# EAGLE design M401H (EAGLE 6.6.0)
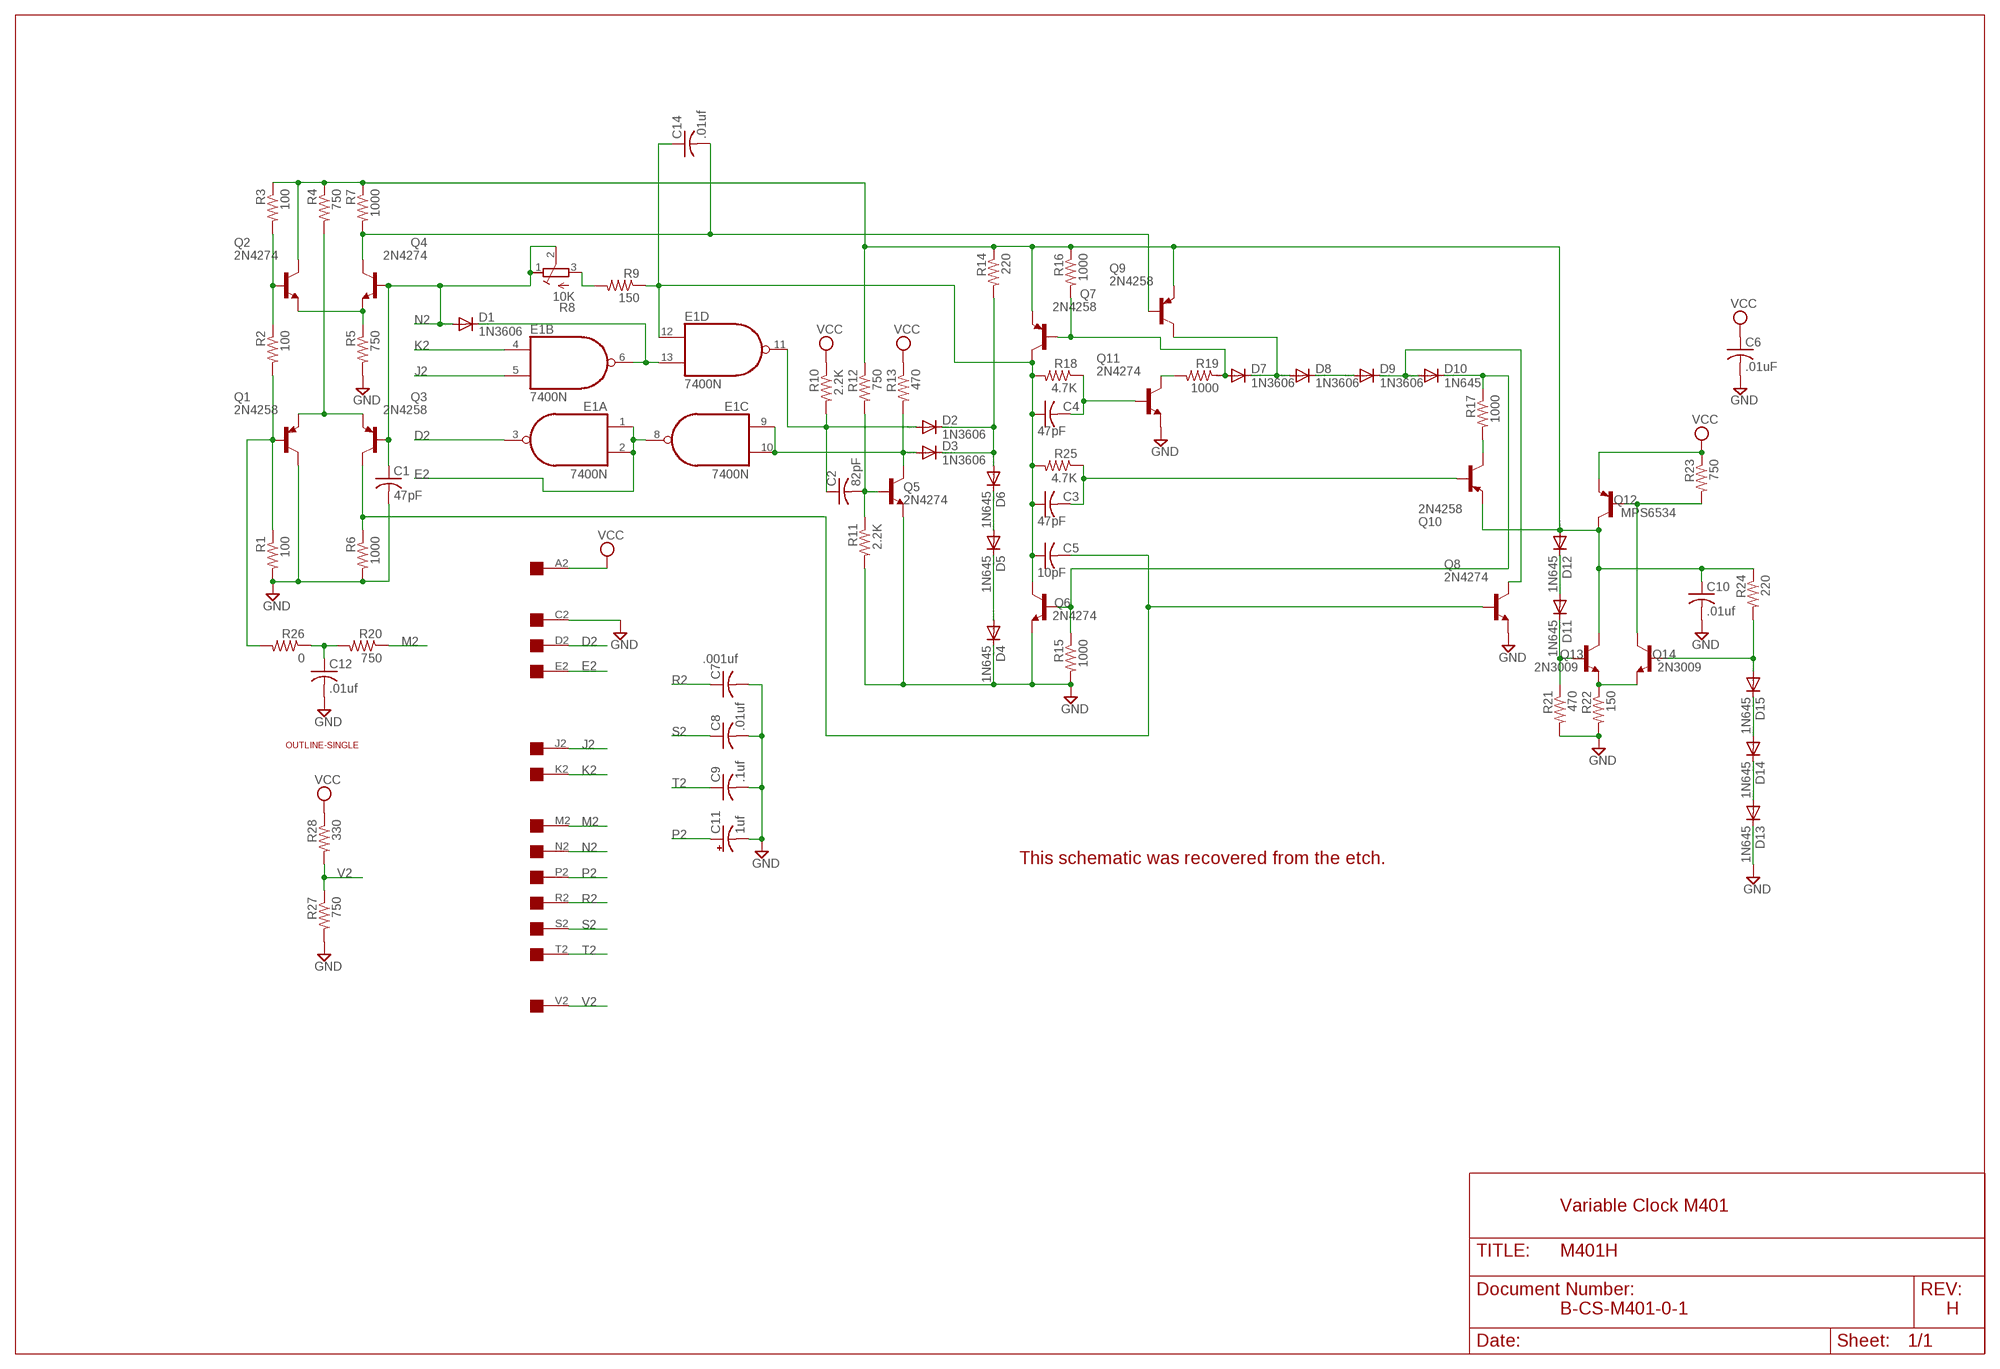
[diagram p0: schematic, sheet 1]

## Parts
C1  47pF  C-US075-032X103  [C075-032X103]
C2  82pF  C-US050-025X075  [C050-025X075]
C3  47pF  C-US050-025X075  [C050-025X075]
C4  47pF  C-US050-025X075  [C050-025X075]
C5  10pF  C-US050-025X075  [C050-025X075]
C6  .01uF  C-US102-043X133  [C102-043X133]
C7  .001uf  C-US075-032X103  [C075-032X103]
C8  .01uf  C-US225-062X268  [C225-062X268]
C9  .1uf  C-US275-093X316  [C275-093X316]
C10  .01uf  C-US050-025X075  [C050-025X075]
C11  1uf  CPOL-USE15-5AXIAL  [E15-5]
C12  .01uf  C-US050-025X075  [C050-025X075]
C14  .01uf  C-US050-025X075  [C050-025X075]
D1  1N3606  1N4148DO35-10  [DO35-10]
D2  1N3606  1N4148DO35-10  [DO35-10]
D3  1N3606  1N4148DO35-10  [DO35-10]
D4  1N645  1N4148DO35-10  [DO35-10]
D5  1N645  1N4148DO35-10  [DO35-10]
D6  1N645  1N4148DO35-10  [DO35-10]
D7  1N3606  1N4148DO35-10  [DO35-10]
D8  1N3606  1N4148DO35-10  [DO35-10]
D9  1N3606  1N4148DO35-10  [DO35-10]
D10  1N645  1N4148DO35-10  [DO35-10]
D11  1N645  1N4148DO35-10  [DO35-10]
D12  1N645  1N4148DO35-10  [DO35-10]
D13  1N645  1N4148DO35-10  [DO35-10]
D14  1N645  1N4148DO35-10  [DO35-10]
D15  1N645  1N4148DO35-10  [DO35-10]
E1  7400N  [DIL14]
Q1  2N4258  2N3637-PNP-TO39-EBC  [TO39]
Q2  2N4274  2N3019-NPN-TO39-EBC  [TO39]
Q3  2N4258  2N3637-PNP-TO39-EBC  [TO39]
Q4  2N4274  2N3019-NPN-TO39-EBC  [TO39]
Q5  2N4274  2N3019-NPN-TO39-EBC  [TO39]
Q6  2N4274  2N3019-NPN-TO39-EBC  [TO39]
Q7  2N4258  2N3637-PNP-TO39-EBC  [TO39]
Q8  2N4274  2N3019-NPN-TO39-EBC  [TO39]
Q9  2N4258  2N3637-PNP-TO39-EBC  [TO39]
Q10  2N4258  2N3637-PNP-TO39-EBC  [TO39]
Q11  2N4274  2N3019-NPN-TO39-EBC  [TO39]
Q12  MPS6534  2N3637-PNP-TO39-EBC  [TO39]
Q13  2N3009  2N3019-NPN-TO39-EBC  [TO39]
Q14  2N3009  2N3019-NPN-TO39-EBC  [TO39]
R1  100  R-US_0207/10  [0207/10]
R2  100  R-US_0207/10  [0207/10]
R3  100  R-US_0207/10  [0207/10]
R4  750  R-US_0207/10  [0207/10]
R5  750  R-US_0207/10  [0207/10]
R6  1000  R-US_0207/10  [0207/10]
R7  1000  R-US_0207/10  [0207/10]
R8  10K  275P  [3006Y]
R9  150  R-US_0207/10  [0207/10]
R10  2.2K  R-US_0207/10  [0207/10]
R11  2.2K  R-US_0207/10  [0207/10]
R12  750  R-US_0207/10  [0207/10]
R13  470  R-US_0207/10  [0207/10]
R14  220  R-US_0207/10  [0207/10]
R15  1000  R-US_0207/10  [0207/10]
R16  1000  R-US_0207/10  [0207/10]
R17  1000  R-US_0207/10  [0207/10]
R18  4.7K  R-US_0207/10  [0207/10]
R19  1000  R-US_0207/10  [0207/10]
R20  750  R-US_0207/10  [0207/10]
R21  470  R-US_0207/10  [0207/10]
R22  150  R-US_0207/10  [0207/10]
R23  750  R-US_0207/10  [0207/10]
R24  220  R-US_0207/10  [0207/10]
R25  4.7K  R-US_0207/10  [0207/10]
R26  0  R-US_0207/10  [0207/10]
R27  750  R-US_0207/10  [0207/10]
R28  330  R-US_0207/10  [0207/10]
U$1  OUTLINE-SINGLE  [SINGLE]
U$2  EDGE-1  [EDGE-CON1]

## Nets
D2: E1.3(A:O) U$2.D2
E2: E1.1(A:I0) E1.2(A:I1) E1.8(C:O) U$2.E2
GND [power]: C1.2 C6.2 C7.2 C8.2 C9.2 C10.2 C11.- C12.2 D4.C D13.C Q1.3(C) Q5.1(E) Q6.1(E) Q8.1(E) Q11.1(E) R1.2 R5.2 R6.2 R11.2 R15.2 R21.2 R22.2 R27.2 U$2.C2
J2: E1.5(B:I1) U$2.J2
K2: E1.4(B:I0) U$2.K2
M2: R20.1 U$2.M2
N2: C1.1 D1.A Q3.2(B) Q4.2(B) R8.1(A) R8.2(S) U$2.N2
N$1: D14.A D15.C
N$2: D13.A D14.C
N$3: D15.A Q14.2(B) R24.2
N$4: Q12.2(B) Q14.3(C) R23.2
N$5: C10.1 D12.A Q2.3(C) Q7.1(E) Q9.1(E) Q10.1(E) Q12.3(C) Q13.3(C) R3.1 R4.1 R7.1 R12.1 R14.1 R16.1 R24.1
N$6: D11.C Q13.2(B) R21.1
N$7: Q13.1(E) Q14.1(E) R22.1
N$8: D11.A D12.C
N$9: R8.3(E) R9.2
N$11: D3.A E1.9(C:I0) E1.10(C:I1) Q5.3(C) R13.2
N$12: D1.C E1.6(B:O) E1.13(D:I1)
N$13: D4.A D5.C
N$14: D8.C D9.A
N$15: Q10.3(C) R17.2
N$16: D7.C D8.A Q9.3(C)
N$17: D9.C D10.A Q8.3(C)
N$18: D7.A Q7.2(B) R16.2 R19.1
N$19: D10.C Q6.2(B) R15.1 R17.1
N$20: D5.A D6.C
N$21: C3.1 C4.1 C5.1 C14.1 E1.12(D:I0) Q6.3(C) Q7.3(C) R9.1 R18.2 R25.2
N$22: C12.1 R20.2 R26.1
N$23: C4.2 Q11.2(B) R18.1
N$24: Q11.3(C) R19.2
N$25: D2.C D3.C D6.A R14.2
N$26: Q1.2(B) R1.1 R2.2 R26.2
N$27: C3.2 Q10.2(B) R25.1
N$28: C2.2 Q5.2(B) R11.1 R12.2
N$29: C5.2 Q3.3(C) Q8.2(B) R6.1
N$30: C2.1 D2.A E1.11(D:O) R10.2
N$32: Q1.1(E) Q3.1(E) R4.2
N$33: C14.2 Q4.3(C) Q9.2(B) R7.2
N$34: Q2.2(B) R2.1 R3.2
N$35: Q2.1(E) Q4.1(E) R5.1
P2: C11.+ U$2.P2
R2: C7.1 U$2.R2
S2: C8.1 U$2.S2
T2: C9.1 U$2.T2
V2: R27.1 R28.2 U$2.V2
VCC [power]: C6.1 Q12.1(E) R10.1 R13.1 R23.1 R28.1 U$2.A2
Unconnected: U$2.B2 U$2.F2 U$2.H2 U$2.L2 U$2.U2

## Notes on the sheet
- This schematic was recovered from the etch.
- Variable Clock M401
- B-CS-M401-0-1 | H

## Power pins joined to a net without a drawn wire
GND: E1.7(P:GND)
VCC: E1.14(P:VCC)

## Library data of the parts
C1-C10 C12 C14 = rcl:C-US: CAPACITOR, American symbol
C11 = rcl:CPOL-US: POLARIZED CAPACITOR, American symbol
D1-D15 = diode:1N4148: DIODE high speed (Philips)
E1 = 74xx-us:74*00: Quad 2-input NAND gate
Q1 Q3 Q7 Q9 Q10 Q12 = transistor:*-PNP-: PNP Transistror
Q2 Q4-Q6 Q8 Q11 Q13 Q14 = transistor:*-NPN-: NPN Transistror BF959 corrected 2008.03.06
R1-R7 R9-R28 = rcl:R-US_: RESISTOR, American symbol
R8 = dec-con:275P: Trimpot with 275P (3006Y) footprint.
U$1 = dec-con:OUTLINE-*: Board outlines for DEC boards.
U$2 = dec-con:EDGE-1: Single-Sided DEC Edge Connector -- (side 2)

## Net classes
1 power: width 0.813 mm

## Board
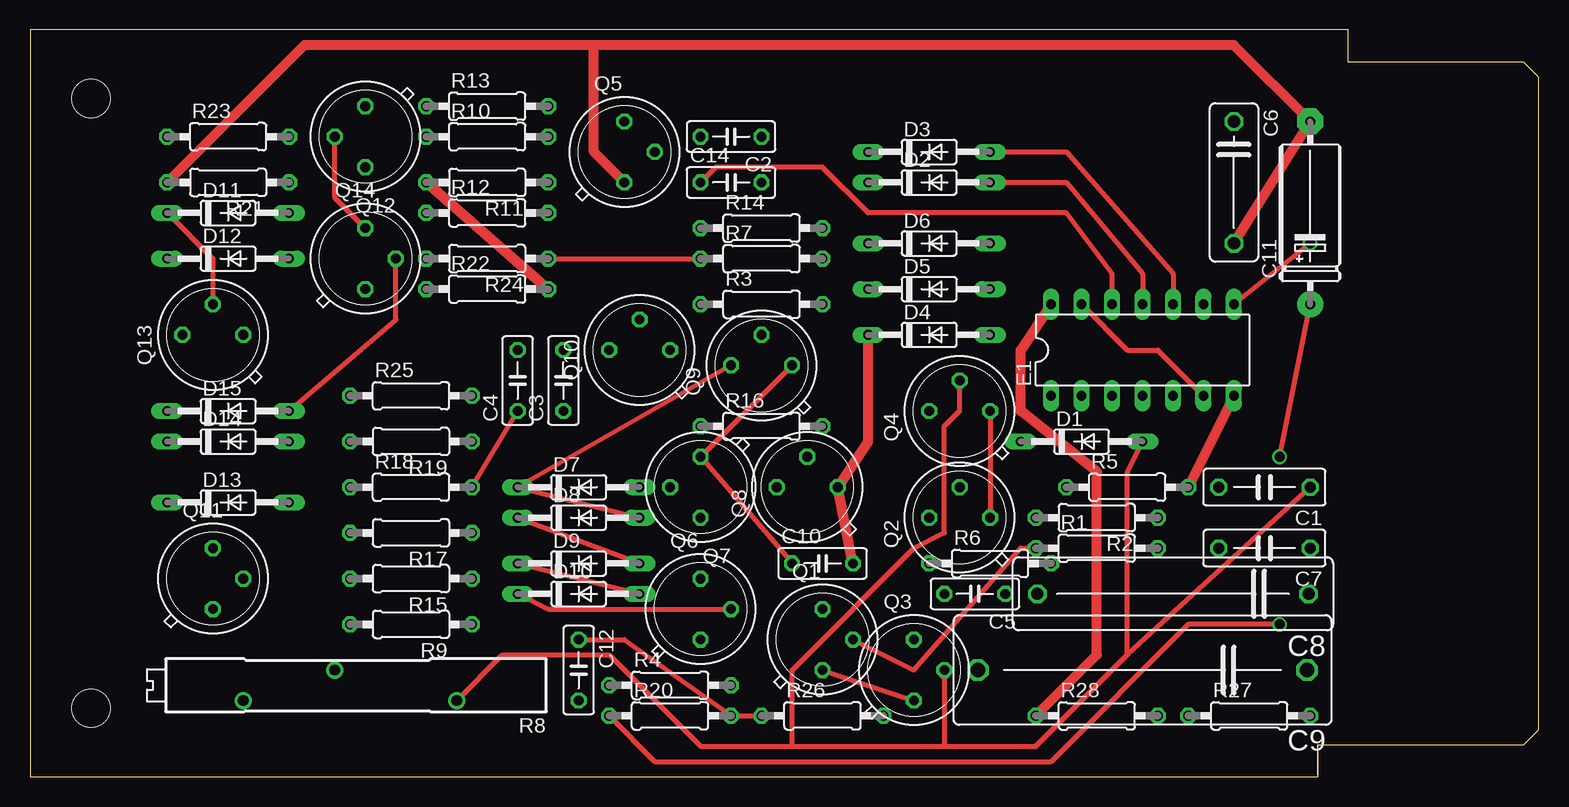
[diagram p1: board, top side]
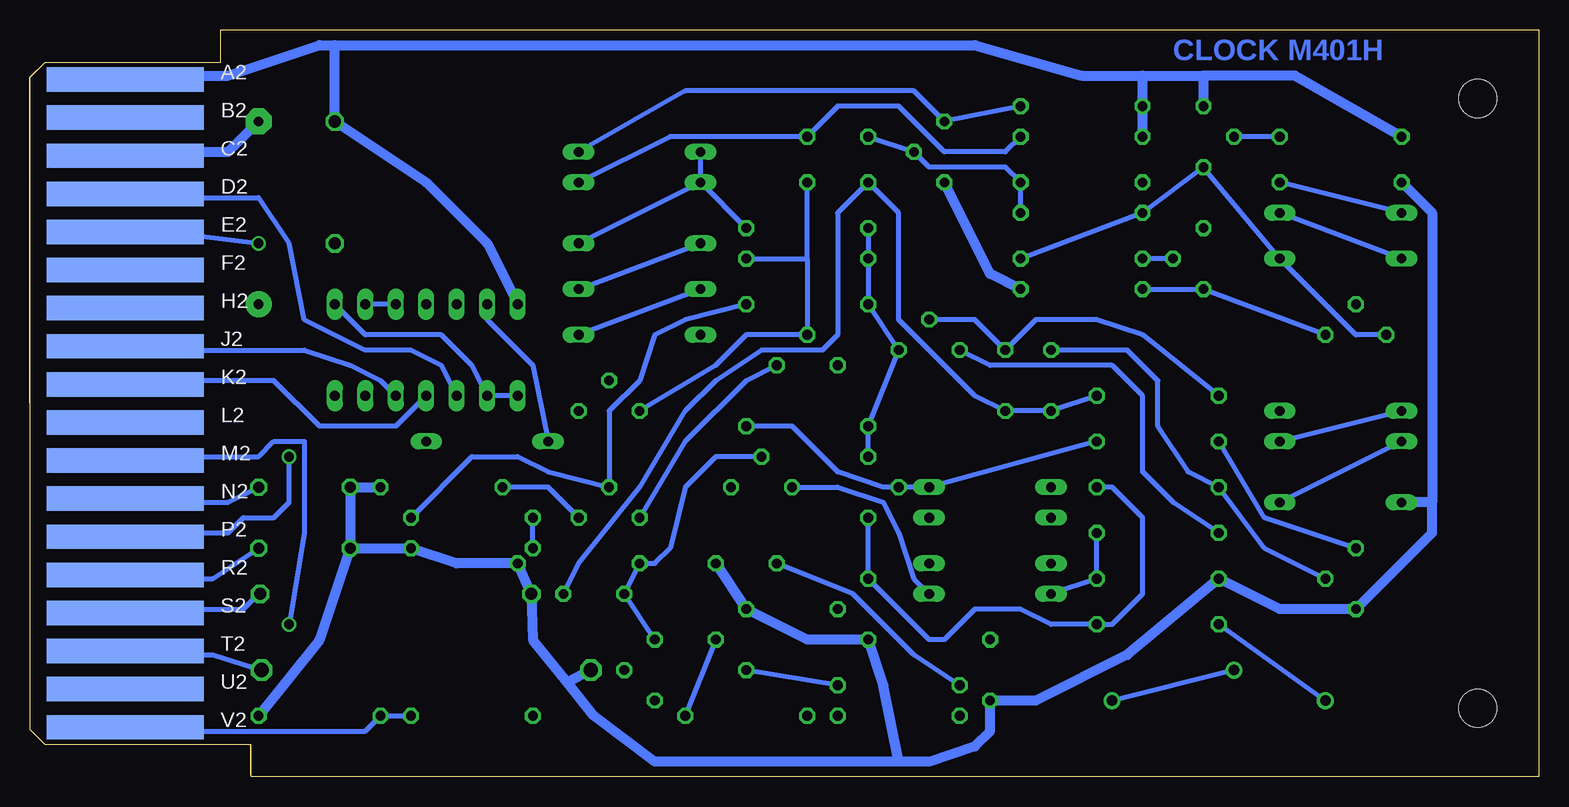
[diagram p2: board, bottom side, seen from below]

Size 125.73 x 62.23 mm. Coordinates in mm from the lower left corner, seen from the top.
Copper layers (1+16): Top 0.035mm / dielectric 1.5mm / Bottom 0.035mm
Design rules "16mils": minimum track width 16mil, minimum drill 32mil, track to track 15mil, track to pad 10mil, pad to pad 10mil, via to via 10mil, smd to smd 10mil, copper to edge 13mil, drill to drill 10mil, minimum pad ring 10mil, minimum via ring 8mil, stop-mask expansion 0mil, vias tented up to drill 0mil, thermal gap 10mil

### Footprints (pad centres in the part's own frame; a part is rotated, then mirrored left to right if it is on the bottom)
C075-032X103 = drill 0.914 octagon: 1 -3.81,0; 2 3.81,0
C050-025X075 = drill 0.813 octagon: 1 -2.54,0; 2 2.54,0
C102-043X133 = drill 1.016 octagon: 1 -5.08,0; 2 5.08,0
C225-062X268 = drill 1.016 octagon: 1 -11.303,0; 2 11.303,0
C275-093X316 = drill 1.194 octagon: 1 -13.716,0; 2 13.716,0
E15-5 = drill 0.813 pad 2.159: + -7.62,0 | drill 0.813 pad 2.159 octagon: - 7.62,0
DO35-10 = drill 0.813 long: A 5.08,0; C -5.08,0
DIL14 = drill 0.813 long: 1 -7.62,-3.81; 2 -5.08,-3.81; 3 -2.54,-3.81; 4 0,-3.81; 5 2.54,-3.81; 6 5.08,-3.81; 7 7.62,-3.81; 8 7.62,3.81; 9 5.08,3.81; 10 2.54,3.81; 11 0,3.81; 12 -2.54,3.81; 13 -5.08,3.81; 14 -7.62,3.81
TO39 = drill 0.813 octagon: 1 0,-2.54; 2 2.54,0; 3 0,2.54
0207/10 = drill 0.813 octagon: 1 -5.08,0; 2 5.08,0
3006Y = drill 0.9: 1 -8.89,1.27; 2 1.27,-1.27; 3 8.89,1.27
SINGLE = hole 3.175: 120.65,56.515; 120.65,5.715
EDGE-CON1 = smd 13.106 x 2.032 bottom: A2 7.938,4.128; B2 7.938,7.303; C2 7.938,10.477; D2 7.938,13.652; E2 7.938,16.828; F2 7.938,20.003; H2 7.938,23.177; J2 7.938,26.352; K2 7.938,29.527; L2 7.938,32.703; M2 7.938,35.877; N2 7.938,39.053; P2 7.938,42.227; R2 7.938,45.403; S2 7.938,48.578; T2 7.938,51.752; U2 7.938,54.928; V2 7.938,58.102

### Placement (x,y rotation side)
C1  102.87,24.13 180 top
C2  58.42,53.34 180 top
C3  44.45,33.02 90 top
C4  40.64,33.02 90 top
C5  78.74,15.24 180 top
C6  100.33,49.53 270 top
C7  102.87,19.05 180 top
C8  95.25,15.24 180 top
C9  92.71,8.89 180 top
C10  66.04,17.78 0 top
C11  106.68,46.99 90 top
C12  45.72,8.89 270 top
C14  58.42,49.53 0 top
D1  87.63,27.94 0 top
D2  74.93,49.53 0 top
D3  74.93,52.07 0 top
D4  74.93,36.83 0 top
D5  74.93,40.64 0 top
D6  74.93,44.45 0 top
D7  45.72,24.13 0 top
D8  45.72,21.59 0 top
D9  45.72,17.78 0 top
D10  45.72,15.24 0 top
D11  16.51,46.99 0 top
D12  16.51,43.18 0 top
D13  16.51,22.86 0 top
D14  16.51,27.94 0 top
D15  16.51,30.48 0 top
E1  92.71,35.56 0 top
Q1  66.04,11.43 0 top
Q2  77.47,21.59 90 top
Q3  73.66,8.89 0 top
Q4  77.47,30.48 90 top
Q5  49.53,52.07 0 top
Q6  55.88,13.97 0 top
Q7  55.88,24.13 180 top
Q8  64.77,24.13 90 top
Q9  60.96,34.29 90 top
Q10  50.8,35.56 90 top
Q11  15.24,16.51 0 top
Q12  27.94,53.34 180 top
Q13  15.24,36.83 90 top
Q14  27.94,43.18 0 top
R1  88.9,19.05 0 top
R2  88.9,21.59 180 top
R3  60.96,39.37 0 top
R4  53.34,7.62 0 top
R5  91.44,24.13 0 top
R6  80.01,17.78 0 top
R7  60.96,43.18 0 top
R8  26.67,7.62 180 top
R9  31.75,12.7 180 top
R10  38.1,53.34 0 top
R11  38.1,49.53 180 top
R12  38.1,46.99 0 top
R13  38.1,55.88 0 top
R14  60.96,45.72 0 top
R15  31.75,16.51 180 top
R16  60.96,29.21 0 top
R17  31.75,20.32 180 top
R18  31.75,24.13 0 top
R19  31.75,27.94 180 top
R20  53.34,5.08 0 top
R21  16.51,49.53 180 top
R22  38.1,40.64 0 top
R23  16.51,53.34 0 top
R24  38.1,43.18 180 top
R25  31.75,31.75 0 top
R26  66.04,5.08 0 top
R27  101.6,5.08 0 top
R28  88.9,5.08 0 top
U$1  125.73,62.23 180 top
U$2  125.73,62.23 180 top

### Tracks (layer width: path | path; a pad name or v marks a point on that pad's centre or on a via)
D2
  Bottom 0.406: E1.3 91.44,34.29 93.98,35.56 97.79,35.56 102.87,38.1 104.14,44.45 106.68,48.26 116.84,48.26 U$2.D2
E2  (via drill 0.81)
  Top 0.406: v106.68,44.45 E1.8
  Bottom 0.406: E1.1 E1.2 88.9,34.29 91.44,36.83 97.79,36.83 E1.8 | U$2.E2 116.84,45.72 v106.68,44.45
GND
  Top 0.813: C6.2 C11.- 100.33,60.96 46.99,60.96 | R11.2 R22.2 | E1.7 R5.2 | 46.99,60.96 22.86,60.96 R21.2 | Q5.1 46.99,52.07 46.99,60.96 | C10.2 Q8.1 69.85,27.94 D4.C
  Bottom 0.813: 8.89,22.86 8.89,20.32 Q11.1 21.59,13.97 R15.2 34.29,10.16 41.91,6.35 C12.2 45.72,3.81 46.99,2.54 50.8,1.27 53.34,1.27 | 8.89,22.86 D13.C | R22.2 45.72,41.91 Q5.1 | 53.34,1.27 54.61,7.62 Q6.1 60.96,11.43 Q1.3 C10.2 | 53.34,1.27 73.66,1.27 78.74,5.08 80.97,7.87 | 80.97,7.87 83.82,11.43 C8.2 R6.2 90.17,17.78 R1.2 C7.2 | C9.2 80.97,7.87 | U$2.C2 116.84,52.07 109.22,52.07 C11.- | C7.2 C1.2 R5.2 | C7.2 101.6,11.43 R27.2 | R21.2 8.89,46.99 8.89,22.86
J2
  Bottom 0.406: U$2.J2 116.84,35.56 102.87,35.56 99.06,34.29 96.52,33.02 E1.5
K2
  Bottom 0.406: E1.4 95.25,29.21 101.6,29.21 105.41,33.02 116.84,33.02 U$2.K2
M2  (via drill 0.81)
  Top 0.406: v104.14,12.7 96.52,12.7 85.09,1.27 52.07,1.27 R20.1
  Bottom 0.406: U$2.M2 116.84,26.67 106.68,26.67 105.41,27.94 102.87,27.94 102.87,20.32 v104.14,12.7
N2
  Top 0.406: R8.1 39.37,10.16 48.26,10.16 55.88,2.54 63.5,2.54 | 63.5,2.54 76.2,2.54 | 76.2,2.54 83.82,2.54 91.44,10.16 | 91.44,10.16 91.44,25.4 D1.A | Q3.2 76.2,2.54 | C1.1 91.44,10.16 | 63.5,2.54 63.5,8.89 73.66,19.05 76.2,20.32 76.2,29.21 77.47,30.48 Q4.2
  Bottom 0.406: R8.2 R8.1 | U$2.N2 116.84,22.86 109.22,22.86 C1.1
N$1
  Bottom 0.406: D14.A D15.C
N$2
  Bottom 0.406: D14.C D13.A
N$3
  Top 0.406: D15.A 30.48,38.1 Q14.2
  Bottom 0.406: Q14.2 R24.2
N$4
  Top 0.406: Q14.3 25.4,48.26 Q12.2
  Bottom 0.406: R23.2 Q12.2
N$5
  Top 0.406: R24.1 R7.1 | C10.1 Q7.1 Q9.1
  Bottom 0.406: Q13.3 15.24,36.83 D12.A Q12.3 R12.1 R24.1 | Q7.1 R16.1 Q10.1 R3.1 R7.1 R14.1 | Q9.1 66.04,33.02 71.12,27.94 Q2.3 | R4.1 52.07,10.16 57.15,15.24 C10.1
N$6
  Top 0.406: D11.C 15.24,43.18 Q13.2
  Bottom 0.406: D11.C R21.1
N$7
  Bottom 0.406: Q13.1 Q14.1 R22.1
N$8
  Bottom 0.406: D12.C D11.A
N$9
  Bottom 0.406: R8.3 R9.2
N$11
  Top 0.406: D3.A 86.36,52.07 95.25,41.91 E1.10
  Bottom 0.406: R13.2 Q5.3 52.07,57.15 71.12,57.15 D3.A | E1.10 E1.9
N$12
  Top 0.406: E1.6 93.98,35.56 91.44,35.56 E1.13
  Bottom 0.406: E1.13 87.63,38.1 83.82,34.29 D1.C
N$13
  Bottom 0.406: D5.C D4.A
N$14
  Top 0.406: D8.C D9.A
N$15
  Bottom 0.406: R17.2 30.48,22.86 33.02,25.4 33.02,31.75 35.56,34.29 45.72,34.29 Q10.3
N$16
  Top 0.406: Q9.3 D7.C D8.A
N$17
  Top 0.406: D9.C D10.A
  Bottom 0.406: Q8.3 58.42,24.13 54.61,22.86 53.34,20.32 52.07,16.51 D10.A
N$18
  Bottom 0.406: R19.1 D7.A Q7.2 54.61,24.13 58.42,25.4 62.23,29.21 R16.2
N$19
  Top 0.406: D10.C 43.18,13.97 Q6.2
  Bottom 0.406: R17.1 R15.1 D10.C
N$20
  Bottom 0.406: D5.A D6.C
N$21
  Top 0.406: R18.2 C4.1 | E1.12 90.17,41.91 86.36,46.99 69.85,46.99 66.04,50.8 57.15,50.8 C14.1
  Bottom 0.406: R18.2 35.56,24.13 33.02,21.59 33.02,15.24 35.56,12.7 R9.1 40.64,12.7 43.18,13.97 46.99,13.97 49.53,11.43 50.8,11.43 Q6.3 Q7.3 | R25.2 C4.1 C3.1 46.99,31.75 53.34,38.1 53.34,46.99 C14.1 58.42,46.99 58.42,36.83 59.69,35.56 64.77,35.56 68.58,33.02 71.12,30.48 74.93,24.13 80.01,17.78 C5.1
N$22
  Top 0.406: C12.1 49.53,11.43 R20.2 R26.1
N$23
  Bottom 0.406: Q11.2 22.86,19.05 R18.1 29.21,25.4 31.75,29.21 31.75,33.02 34.29,35.56 C4.2
N$24
  Bottom 0.406: Q11.3 22.86,21.59 R19.2
N$25
  Bottom 0.406: D2.C D3.C | R14.2 D2.C | D2.C D6.A
N$26
  Top 0.406: Q1.2 73.66,8.89 82.55,19.05 R1.1
  Bottom 0.406: Q1.2 R26.2 | R1.1 R2.2
N$27
  Bottom 0.406: R25.1 33.02,36.83 36.83,38.1 41.91,38.1 C3.2 46.99,38.1 Q10.2
N$28
  Bottom 0.406: C2.2 Q5.2 50.8,50.8 44.45,50.8 R11.1 R12.2
N$29
  Bottom 0.406: Q8.2 68.58,26.67 71.12,24.13 72.39,19.05 73.66,17.78 R6.1 C5.2 Q3.3
N$30
  Top 0.406: D2.A 86.36,49.53 92.71,41.91 E1.11
  Bottom 0.406: R10.2 44.45,52.07 49.53,52.07 53.34,55.88 58.42,55.88 C2.1 72.39,53.34 D2.A
N$32
  Top 0.406: Q1.1 Q3.1
  Bottom 0.406: R4.2 Q1.1
N$33
  Bottom 0.406: Q4.3 68.58,34.29 66.04,36.83 Q9.2 60.96,43.18 | R7.2 60.96,43.18 | 60.96,43.18 C14.2
N$34
  Bottom 0.406: R2.1 88.9,26.67 85.09,26.67 82.55,25.4 Q2.2 77.47,30.48 74.93,33.02 73.66,36.83 71.12,38.1 R3.2
N$35
  Top 0.406: Q4.1 Q2.1
  Bottom 0.406: Q2.1 82.55,24.13 R5.1
P2  (via drill 0.81)
  Top 0.406: v104.14,26.67 C11.+
  Bottom 0.406: U$2.P2 116.84,20.32 109.22,20.32 107.95,21.59 105.41,21.59 104.14,22.86 v104.14,26.67
R2
  Bottom 0.406: U$2.R2 116.84,16.51 110.49,16.51 C7.1
S2
  Bottom 0.406: U$2.S2 116.84,13.97 107.95,13.97 106.68,15.24 C8.1
T2
  Bottom 0.406: U$2.T2 116.84,10.16 110.49,10.16 C9.1
V2
  Bottom 0.406: U$2.V2 116.84,3.81 97.79,3.81 R27.1 R28.2
VCC
  Top 0.813: R28.1 88.9,10.16 88.9,25.4 82.55,30.48 82.55,35.56 E1.14
  Bottom 0.813: R23.1 20.32,58.42 27.94,58.42 | 27.94,58.42 Q12.1 | 33.02,58.42 R13.1 R10.1 | 33.02,58.42 27.94,58.42 | U$2.A2 116.84,58.42 109.22,58.42 101.6,60.96 100.33,60.96 | 100.33,60.96 46.99,60.96 38.1,58.42 33.02,58.42 | E1.14 87.63,44.45 92.71,49.53 C6.1 100.33,60.96

### Text on the board
Bottom: CLOCK M401H
200bmp: //wsl$/Debian/home/vrs/Eagle/projects/DEC/Mxxx/M401/M401Hbackfb.bmp